# Altium schematic sheet 激光昆虫蓝牙版.SchDoc
size A3
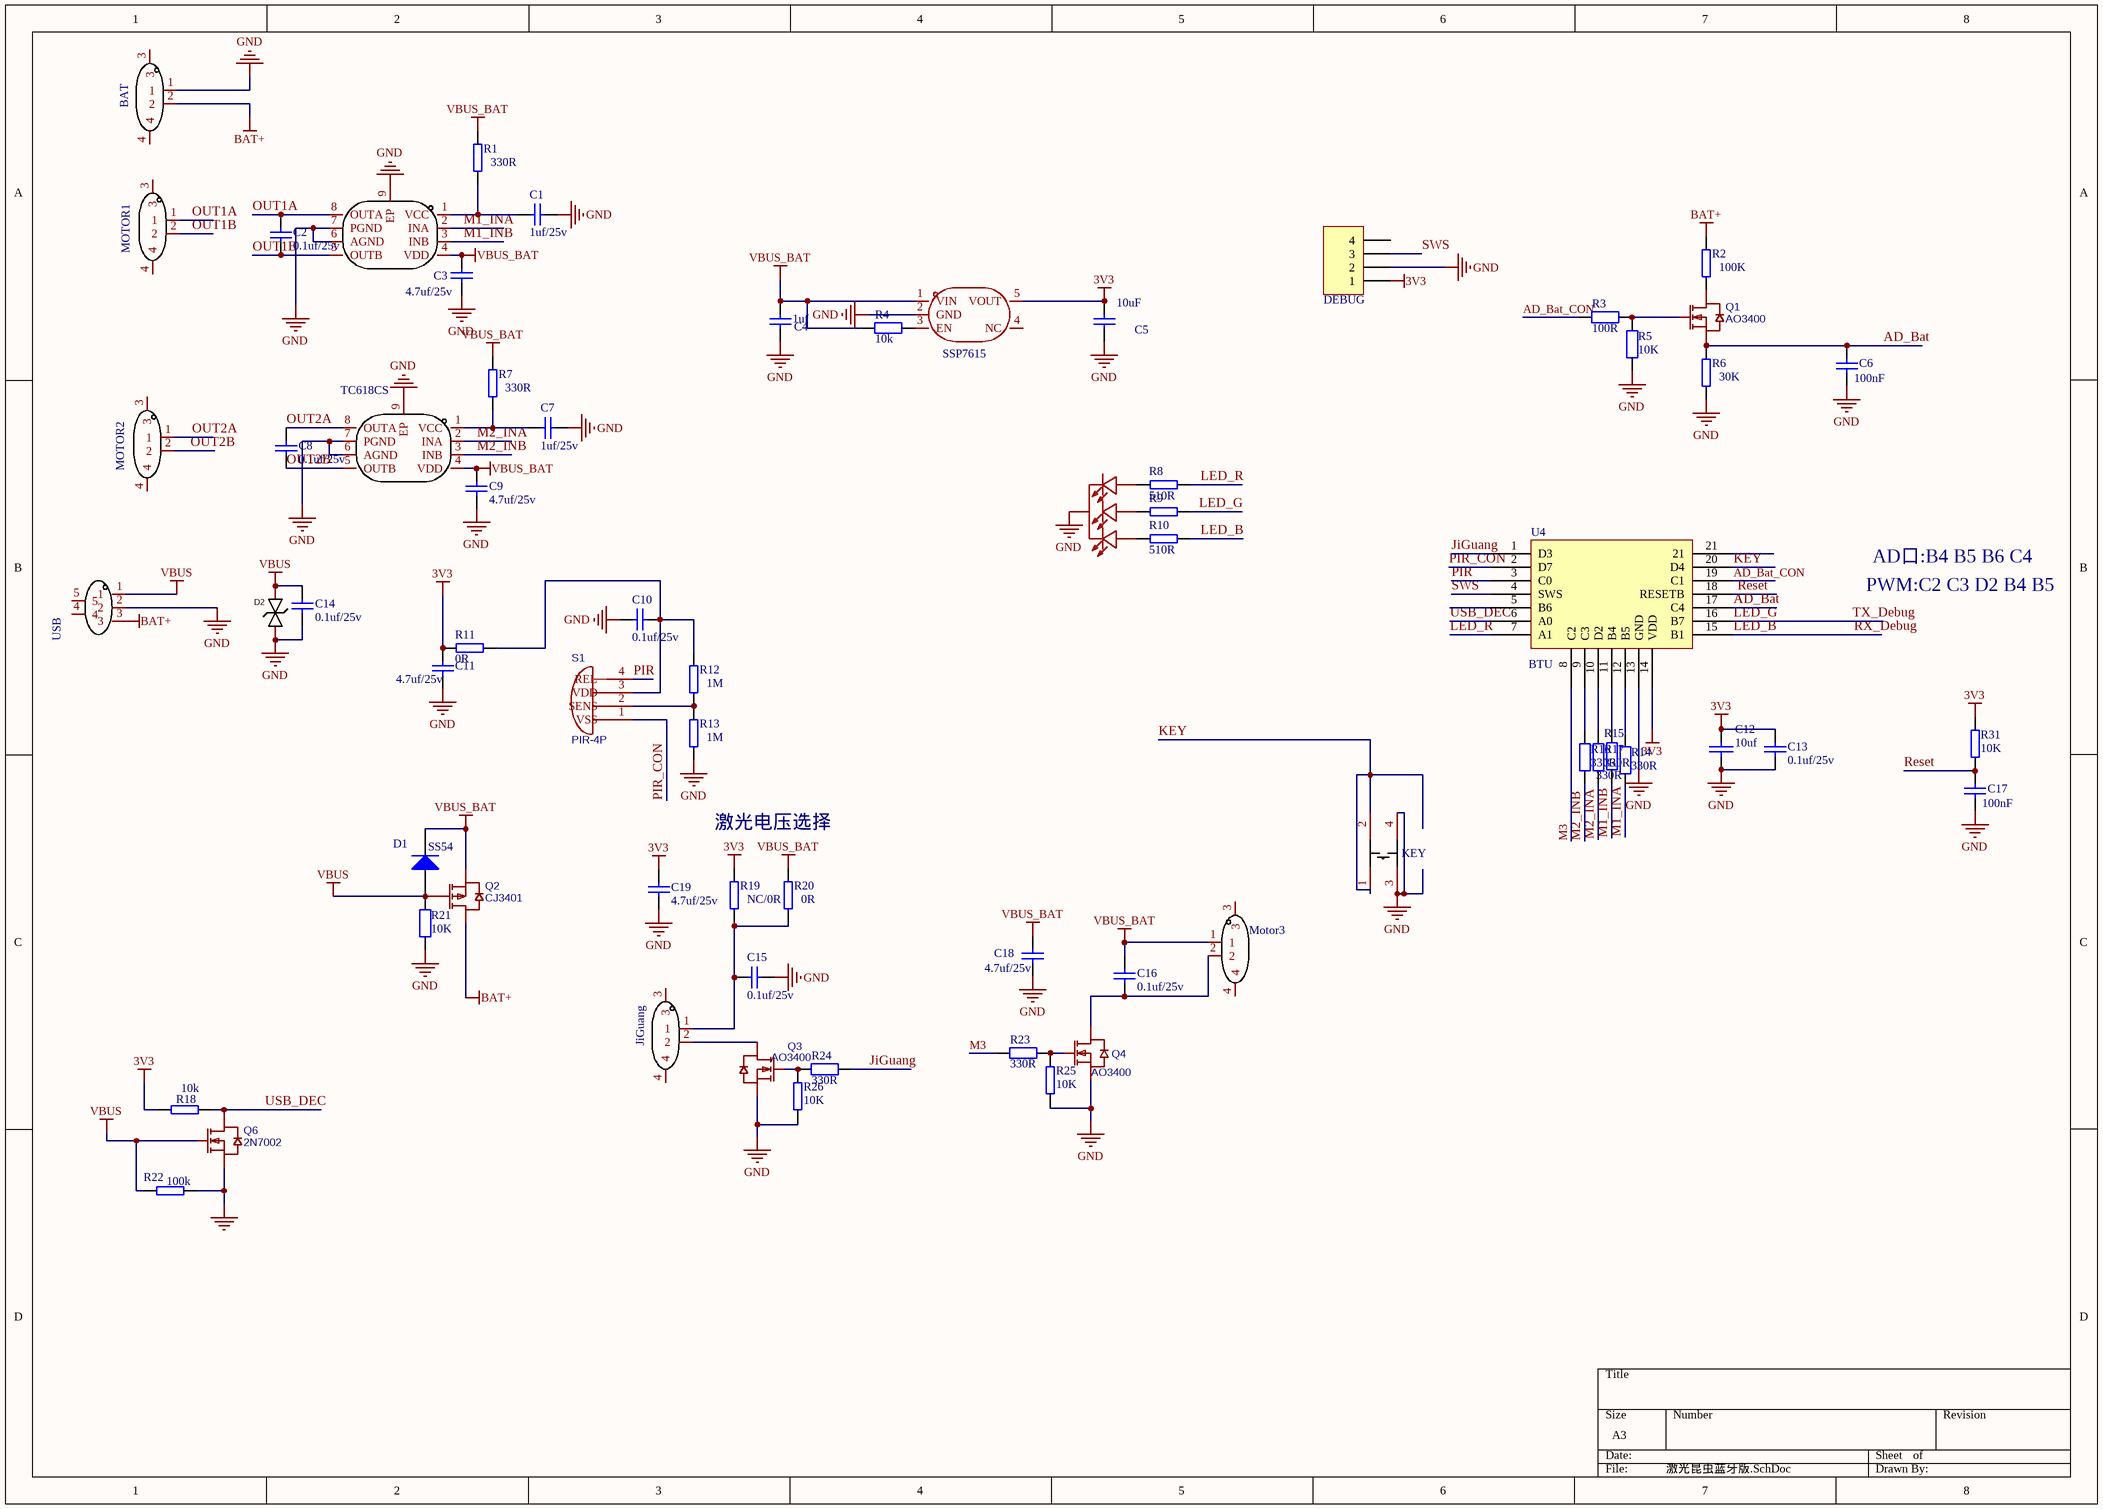
[diagram p0: 激光昆虫蓝牙版.SchDoc]

## Parts
C1  1uf/25v  [0603_C]
C2  0.1uf/25v  [0603_C]
C3  4.7uf/25v  [0603_C]
C4  1uf  [0603_C]
C5  10uF  [0603_C]
C6  100nF  [0603_C]
C7  1uf/25v  [0603_C]
C8  0.1uf/25v  [0603_C]
C9  4.7uf/25v  [0603_C]
C10  0.1uf/25v  [0603_C]
C11  4.7uf/25v  [0603_C]
C12  10uf  [0603_c]
C13  0.1uf/25v  [0603_C]
C14  0.1uf/25v  [0603_C]
C15  0.1uf/25v  [0603_C]
C16  0.1uf/25v  [0603_C]
C17  100nF  [0603_C]
C18  4.7uf/25v  [0603_C]
C19  4.7uf/25v  [0603_C]
CN1  BAT  [CONN-SMD_2.0-2PLT]
CN2  MOTOR1  [SMD_HC-1.25-2PLT]
CN3  MOTOR2  [SMD_HC-1.25-2PLT]
CN4  USB  [SMD_HC-1.25-3PLT]
CN5  Motor3  [SMD_HC-1.25-2PLT]
CN6  JiGuang  [SMD_HC-1.25-2PLT]
D1  SS54  [SMA]
D2  SMF6.0CA  [SOD-123 双向]  (value not drawn)
K1  KEY  [KEY_SMD_4P]
LED1  tj-s1615cy6tglccsrgb-a5  [LED-ARRAY-SMD_4P-L1.6-W1.5-BL-FD]  (value not drawn)
P1  DEBUG  [SIP3-2.54]
Q1  AO3400  [SOT-23]
Q2  CJ3401  [SOT-23]
Q3  AO3400  [SOT-23]
Q4  AO3400  [SOT-23]
Q6  2N7002  [SOT-23]
R1  330R  [0603_R]
R2  100K  [0603_R]
R3  100R  [0603_r]
R4  10k  [0603_R]
R5  10K  [0603_r]
R6  30K  [0603_R]
R7  330R  [0603_R]
R8  510R  [0603_R]
R9  510R  [0603_R]  (value not drawn)
R10  510R  [0603_R]
R11  0R  [0603_R]
R12  1M  [0603_R]
R13  1M  [0603_R]
R14  330R  [0603_R]
R15  330R  [0603_R]
R16  330R  [0603_R]
R17  330R  [0603_R]
R18  10k  [0603_R]
R19  NC/0R  [0603_R]
R20  0R  [0603_R]
R21  10K  [0603_R]
R22  100k  [0603_R]
R23  330R  [0603_R]
R24  330R  [0603_R]
R25  10K  [0603_R]
R26  10K  [0603_R]
R31  10K  [0603_R]
S1  PIR-4P  [PIR-D-4P]
U1  TC618CS  [ESOP-8]  (value not drawn)
U2  SSP7615  [SOT-23-5]
U3  TC618CS  [ESOP-8]
U4  BTU  [BTU]

## Nets
3V3: C5.2 C11.1 C12.2 C13.1 C19.1 P1.1 R11.1 R18.1 R19.1 R31.1 U2.5(VOUT) U4.14(VDD)
BAT+: CN1.2 CN4.3 Q2.3(D) R2.1
GND: C1.2 C3.2 C4.1 C5.1 C6.1 C7.2 C9.2 C10.2 C11.2 C12.1 C13.2 C14.2 C15.1 C17.1 C18.1 C19.2 CN1.1 CN4.2 D2.1 K1.3 K1.4 LED1.1(C) P1.2 Q3.2(S) Q4.2(S) Q6.2(S) R5.1 R6.2 R13.2 R21.1 R22.2 R25.1 R26.1 U1.6(AGND) U1.7(PGND) U1.9(EP) U2.2(GND) U3.6(AGND) U3.7(PGND) U3.9(EP) U4.13(GND)
VBUS: C14.1 CN4.1 D1.1(A) D2.2 Q2.1(G) Q6.1(G) R21.2 R22.1
VBUS_BAT: C3.1 C4.2 C9.1 C16.2 C18.2 CN5.1 D1.2(K) Q2.2(S) R1.1 R4.1 R7.1 R20.1 U1.4(VDD) U2.1(VIN) U3.4(VDD)
AD_Bat: C6.2 Q1.2(S) R6.1 U4.17(C4)
AD_Bat_CON: R3.2 U4.19(C1)
JiGuang: R24.2 U4.1(D3)
KEY: K1.1 K1.2 U4.20(D4)
LED_B: R10.1 U4.15(B1)  [also labelled RX_Debug]
LED_G: R9.1 U4.16(B7)  [also labelled TX_Debug]
LED_R: R8.1 U4.7(A1)
M1_INA: R14.2 U1.2(INA)
M1_INB: R15.2 U1.3(INB)
M2_INA: R17.2 U3.2(INA)
M2_INB: R16.2 U3.3(INB)
M3: R23.2 U4.8(C2)
OUT1A: C2.1 CN2.1 U1.8(OUTA)
OUT1B: C2.2 CN2.2 U1.5(OUTB)
OUT2A: C8.1 CN3.1 U3.8(OUTA)
OUT2B: C8.2 CN3.2 U3.5(OUTB)
PIR: S1.4(REL) U4.3(C0)
PIR_CON: S1.1(VSS) U4.2(D7)
Reset: C17.2 R31.2 U4.18(RESETB)
SWS: P1.3 U4.4(SWS)
USB_DEC: Q6.3(D) R18.2 U4.6(A0)
NetC1_1: C1.1 R1.2 U1.1(VCC)
NetC7_1: C7.1 R7.2 U3.1(VCC)
NetC10_1: C10.1 R11.2 R12.1 S1.3(VDD)
NetC15_2: C15.2 CN6.1 R19.2 R20.2
NetC16_1: C16.1 CN5.2 Q4.3(D)
NetCN6_2: CN6.2 Q3.3(D)
NetLED1_2: LED1.2(B) R10.2
NetLED1_3: LED1.3(G) R9.2
NetLED1_4: LED1.4(R) R8.2
NetQ1_1: Q1.1(G) R3.1 R5.2
NetQ1_3: Q1.3(D) R2.2
NetQ3_1: Q3.1(G) R24.1 R26.2
NetQ4_1: Q4.1(G) R23.1 R25.2
NetR4_2: R4.2 U2.3(EN)
NetR12_2: R12.2 R13.1 S1.2(SENS)
NetR14_1: R14.1 U4.12(B5)
NetR15_1: R15.1 U4.11(B4)
NetR16_1: R16.1 U4.9(C3)
NetR17_1: R17.1 U4.10(D2)

Not connected (* = marked no-connect by the designer): CN1 3 4; CN2 3 4; CN3 3 4; CN4 4 5; CN5 3 4; CN6 3 4; P1 4; U2 4(NC); U4 5(B6) 21

## Notes on the sheet
- AD口:B4 B5 B6 C4
- PWM:C2 C3 D2 B4 B5
- 激光电压选择

## Library data of the parts
C1-C3 C5 C7-C11 C13-C16 C18 C19 = Cap: Capacitor; Value: 10nF; Published: 8-Jun-2000; Revision: July-2002: Re-released for DXP Platform.; Publisher: Altium Limited
C4 = Cap1: 无极电容
C6 C17 = CAP
C12 = C-0603: C-?-K-0603; CompNAME: 贴片电容; $MaterialClass: Component; $MaterialID: 12063014; CompCLASSIFICATION: ;电子元器件; Comp_Spec: C-104-50V-X7R-M-0603; CompID: 12063014
CN1-CN3 CN5 CN6 = HC-1.25-2PLT: Add into BOM: yes; Pins Structure: 1x2P; Pitch: 1.25mm; Number of PINs Per Row: 2; Current Rating (Max): 2A; Symbol: HC-1.25-2PLT; Device: HC-1.25-2PLT; Supplier Part: C2845388; Manufacturer Part: HC-1.25-2PLT; Supplier Footprint: SMD,P=1.25mm; JLCPCB Part Class: Extended Part; Datasheet: https://atta.szlcsc.com/upload/public/pdf/source/20230707/8E5913B5A3195C18F5EE12EA4CB86B82.pdf; Supplier: LCSC; Convert to PCB: yes; Reference Series: -; Number of Pins: 2P; Number of Rows: 1; Row Spacing: -
CN4 = HC-1.25-3PLT: Add into BOM: yes; Pins Structure: 1x3P; Pitch: 1.25mm; Number of PINs Per Row: 3; Current Rating (Max): 2A; Symbol: HC-1.25-3PLT; Device: HC-1.25-3PLT; Supplier Part: C2845389; Manufacturer Part: HC-1.25-3PLT; Supplier Footprint: SMD,P=1.25mm; JLCPCB Part Class: Extended Part; Datasheet: https://atta.szlcsc.com/upload/public/pdf/source/20230707/8E5913B5A3195C18F5EE12EA4CB86B82.pdf; Supplier: LCSC; Convert to PCB: yes; Reference Series: -; Number of Pins: 3P; Number of Rows: 1; Row Spacing: -
D1 = Diode 1N4148: High Conductance Fast Diode; Published: 8-Jun-2000; LatestRevisionDate: 17-Jul-2002; LatestRevisionNote: Re-released for DXP Platform.; DatasheetVersion: 1997; PackageReference: DO-35; Publisher: Altium Limited; PackageDescription: Diode, Axial; Body 3.8 x 1.9 mm (LxDia. max), Lead Dia. 0.53 mm (max); Code_JEDEC: DO-204-AH; ComponentLink1Description: Manufacturer Link; ComponentLink1URL: http://www.fairchildsemi.com/; ComponentLink2Description: Datasheet; ComponentLink2URL: http://www.fairchildsemi.com/ds/1N%2F1N4148.pdf
D2 = SMF5.0CA_C726939: Add into BOM: yes; Symbol: SMF5.0CA_C726939; Device: SMF5.0CA_C726939; Supplier: LCSC; Supplier Part: C726939; Manufacturer Part: SMF5.0CA; JLCPCB Part Class: Extended Part; LCSC Part Name: SMF5.0CA; Supplier Footprint: SOD-123FL; Datasheet: https://atta.szlcsc.com/upload/public/pdf/source/20200825/C726891_B615A55314C94A3B16B7FBCD32D40567.pdf; Convert to PCB: yes
K1 = TS-1002S-05026C: Add into BOM: yes; Switch Length: 6mm; Switch Height: 5mm; Contact Current: 50mA; Voltage Rating (DC): 12V; Symbol: TS-1002S-05026C; Device: TS-1002S-05026C; Supplier: LCSC; Supplier Part: C455110; Manufacturer Part: TS-1002S-05026C; JLCPCB Part Class: Extended Part; Supplier Footprint: SMD,6x6mm; Datasheet: https://atta.szlcsc.com/upload/public/pdf/source/20191118/C455126_F61E8FA1ED640FB1CE0B30B55DEB62E3.pdf; Convert to PCB: yes; Switch Width: 6mm; With Lamp: -; Mechanical Life: -
LED1 = tj-s1615cy6tglccsrgb-a5: AddInBom: yes; ModelId: 019f67a467ef428fb4751750941ad806; ModelName: LED-ARRAY-SMD_4P-L1.6-W1.5-H0.6-BL-FD; ModelTransform: 62.992,59.094,0,0,0,0,0,0,0; Symbol: TJ-S1615CY6TGLCCSRGB-A5; SupplierPart: C601684; ManufacturerPart: TJ-S1615CY6TGLCCSRGB-A5; Supplier Footprint: SMD-4P,1.6x1.5mm; JLCPCB Part Class: Extended Part; Datasheet: https://item.szlcsc.com/datasheet/TJ-S1615CY6TGLCCSRGB-A5/631042.html; Supplier: LCSC; ConvertToPcb: yes; FootprintName: LED-ARRAY-SMD_4P-L1.6-W1.5-BL-FD
P1 = Header 4: Header, 4-Pin; LatestRevisionDate: 17-Jul-2002; LatestRevisionNote: Re-released for DXP Platform.; Publisher: Altium Limited
Q1 Q3 Q4 Q6 = JMTL3400A: Contributor: LCSC; BOM_Supplier: LCSC; BOM_Supplier Part: C2890442; BOM_Manufacturer Part: JMTL3400A; BOM_JLCPCB Part Class: Extended Part; spicePre: Q; spiceSymbolName: JMTL3400A
Q2 = CJ3401: BOM_Manufacturer: CJ; BOM_Supplier: LCSC; BOM_Manufacturer Part: CJ3401; BOM_Supplier Part: C13799; BOM_JLCPCB Part Class: Extended Part; spicePre: Q; spiceSymbolName: CJ3401
R1 R2 R6-R13 R18-R20 R22 R25 R26 R31 = RES
R3-R5 R14-R17 R21 R23 R24 = Res2: Resistor; Value: 120R; Published: 8-Jun-2000; LatestRevisionDate: 17-Jul-2002; LatestRevisionNote: Re-released for DXP Platform.; PackageReference: AXIAL-0.4; Publisher: Altium Limited
S1 = PIR-4P: BOM_Manufacturer Part: RE200B-P; BOM_Manufacturer: Nicera; BOM_Supplier: LCSC; BOM_Supplier Part: C81765; BOM_JLCPCB Part Class: Extended Part; spicePre: S; spiceSymbolName: RE200B-P
U1 U3 = TC618CS: Add into BOM: yes; Symbol: TC618CS; Device: TC618CS; LCSC Part Name: TC618CS; Supplier Part: C841297; Manufacturer Part: TC618CS; Supplier Footprint: ESOP-8; JLCPCB Part Class: Extended Part; Datasheet: https://atta.szlcsc.com/upload/public/pdf/source/20220419/1F76DE07CE75E396806FE277B3C61CFC.pdf; Supplier: LCSC; Convert to PCB: yes
U2 = SSP7615-33M5R: Symbol: SSP7615-33M5R